# Altium schematic sheet Eth.SchDoc
size A; SheetNumber: 7; SheetTotal: 7
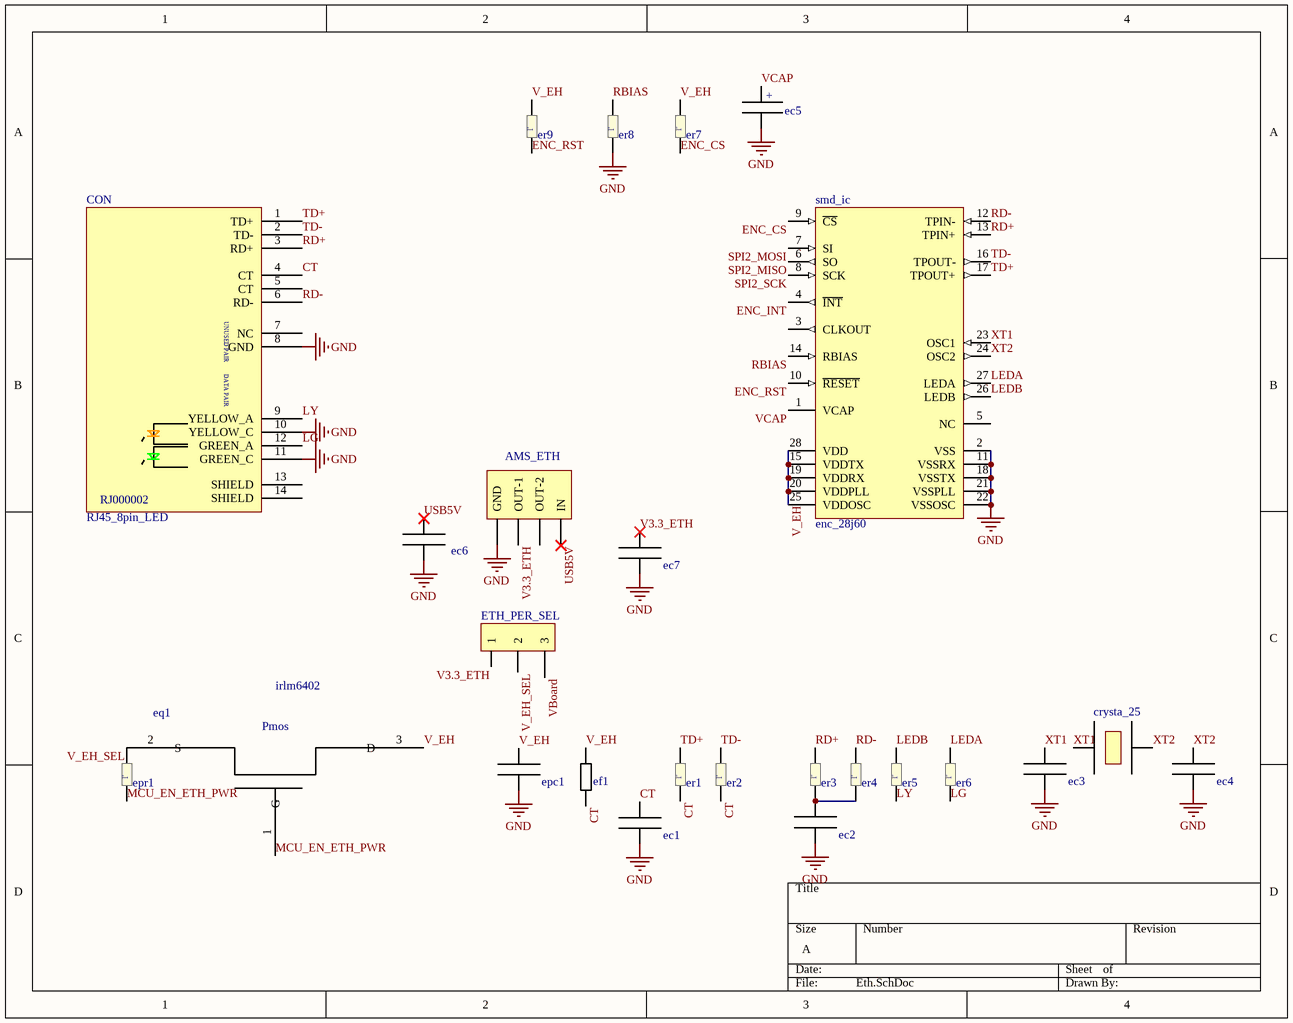
[diagram p0: Eth.SchDoc]

## Parts
AMS_ETH  Regulator  [abr_fp_SOT-223_3d]  (value not drawn)
CON  RJ45_8pin_LED  [abr_eth_RJ45_8pin_LED_3d]
crysta_25  crystal  [abr_crystal_dip_3d]  (value not drawn)
ec1  100nf  [abr_cap_0805_3d]  (value not drawn)
ec2  100nf  [abr_cap_0805_3d]  (value not drawn)
ec3  100nf  [abr_cap_0805_3d]  (value not drawn)
ec4  100nf  [abr_cap_0805_3d]  (value not drawn)
ec5  10uf  [abr_cap_a_3d]  (value not drawn)
ec6  1uf  [abr_cap_0805_3d]  (value not drawn)
ec7  1uf  [abr_cap_0805_3d]  (value not drawn)
ef1  smd-0805  [abr_fer_0805_3d]  (value not drawn)
epc1  100nf  [abr_cap_0805_3d]  (value not drawn)
epr1  10k  [abr_res_0805_3d]  (value not drawn)
eq1  irlm6402  [irlm6402]
er1  49.9  [abr_res_0805_3d]  (value not drawn)
er2  49.9  [abr_res_0805_3d]  (value not drawn)
er3  49.9  [abr_res_0805_3d]  (value not drawn)
er4  49.9  [abr_res_0805_3d]  (value not drawn)
er5  1k  [abr_res_0805_3d]  (value not drawn)
er6  1k  [abr_res_0805_3d]  (value not drawn)
er7  10k  [abr_res_0805_3d]  (value not drawn)
er8  2.3k  [abr_res_0805_3d]  (value not drawn)
er9  10k  [abr_res_0805_3d]  (value not drawn)
ETH_PER_SEL  pin header 2mm  [abr_ph_3x1_2mm_2d_male]  (value not drawn)
smd_ic  enc_28j60  [abr_eth_enc28j60_3d]

## Nets
GND: AMS_ETH.1(GND) CON.8(GND) CON.10(YELLOW_C) CON.11(GREEN_C) ec1.0 ec2.0 ec3.0 ec4.0 ec5.1 ec6.0 ec7.0 epc1.0 er8.0 smd_ic.2(VSS) smd_ic.11(VSSRX) smd_ic.18(VSSTX) smd_ic.21(VSSPLL) smd_ic.22(VSSOSC)
CT: CON.4(CT) ec1.1 ef1.1 er1.0 er2.0
ENC_CS: er7.0 smd_ic.9(~{CS})
ENC_INT: smd_ic.4(~{INT})
ENC_RST: er9.0 smd_ic.10(~{RESET})
LEDA: er6.1 smd_ic.27(LEDA)
LEDB: er5.1 smd_ic.26(LEDB)
LG: CON.12(GREEN_A) er6.0
LY: CON.9(YELLOW_A) er5.0
MCU_EN_ETH_PWR: epr1.0 eq1.1(G)
RBIAS: er8.1 smd_ic.14(RBIAS)
RD+: CON.3(RD+) er3.1 smd_ic.13(TPIN+)
RD-: CON.6(RD-) er4.1 smd_ic.12(TPIN-)
SPI2_MISO: smd_ic.6(SO)
SPI2_MOSI: smd_ic.7(SI)
SPI2_SCK: smd_ic.8(SCK)
TD+: CON.1(TD+) er1.1 smd_ic.17(TPOUT+)
TD-: CON.2(TD-) er2.1 smd_ic.16(TPOUT-)
USB5V: AMS_ETH.3(IN) ec6.1
V3.3_ETH: AMS_ETH.2(OUT-1) ec7.1 ETH_PER_SEL.1
V_EH: ef1.0 epc1.1 eq1.3(D) er7.1 er9.1 smd_ic.15(VDDTX) smd_ic.19(VDDRX) smd_ic.20(VDDPLL) smd_ic.25(VDDOSC) smd_ic.28(VDD)
V_EH_SEL: epr1.1 eq1.2(S) ETH_PER_SEL.2
VBoard: ETH_PER_SEL.3
VCAP: ec5.0(+) smd_ic.1(VCAP)
XT1: crysta_25.1 ec3.1 smd_ic.23(OSC1)
XT2: crysta_25.2 ec4.1 smd_ic.24(OSC2)
Netec2_1: ec2.1 er3.0 er4.0

Not connected (* = marked no-connect by the designer): AMS_ETH 4(OUT-2); CON 5(CT) 7(NC) 13(SHIELD) 14(SHIELD); smd_ic 3(CLKOUT) 5(NC)

## Notes on the sheet
- (in symbol abr_res_0805) r
- (in symbol irlm6402) Pmos
- (in symbol RJ45_8pin_LED) UNUSED PAIR; DATA PAIR; RJ000002

## Library data of the parts
AMS_ETH = abr_reg_AMS1117
crysta_25 = abr_crystal
ec1-ec4 ec6 ec7 epc1 = abr_cap_0805
ec5 = abr_cap
ef1 = abr_fer_0805
epr1 er1-er9 = abr_res_0805
ETH_PER_SEL = abr_ph_3x1_2mm